# Altium schematic sheet ltc1474_400mA.SchDoc
size A4
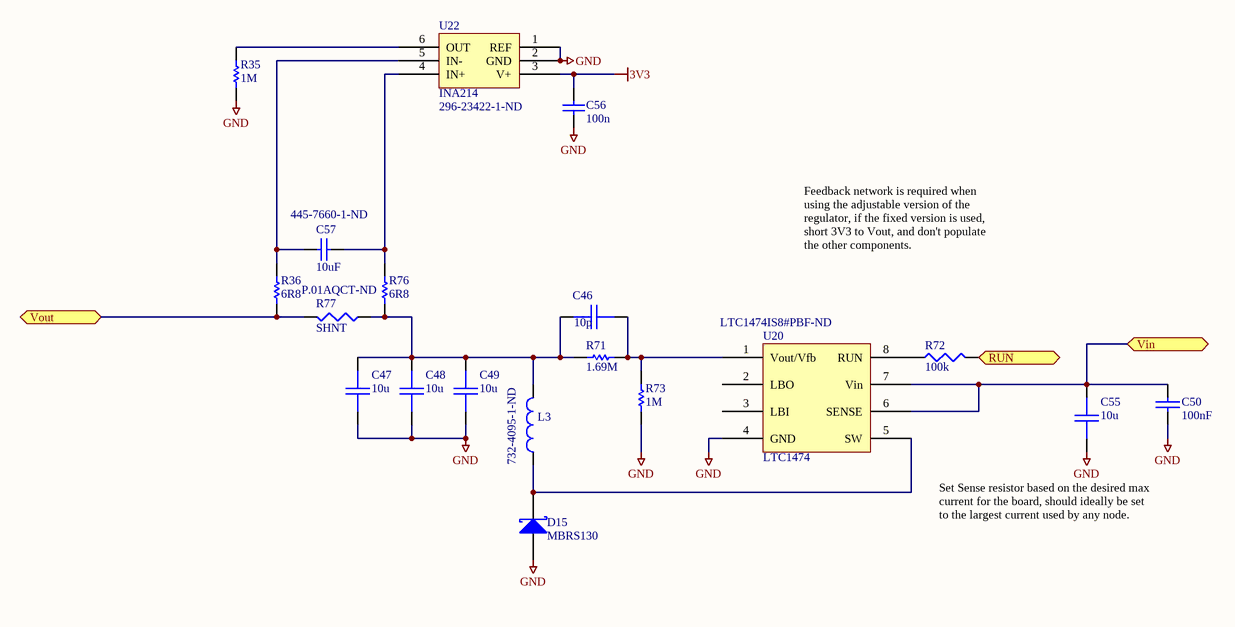
[diagram p0: ltc1474_400mA.SchDoc]

## Parts
C46  10p  [0603]
C47  10u  [1206]
C48  10u  [1206]
C49  10u  [1206]
C50  100nF  [0603]
C55  10u  [1206]
C56  100n  [0603]
C57  10uF  Supplier Part Number 1: 445-7660-1-ND  [0805]
D15  MBRS130  [SMB]
L3  Supplier Part Number 1: 732-4095-1-ND  [WE-TPC-744065221]  (hidden comment: INDUCTOR)
R35  1M  [0603]
R36  6R8  [0603]
R71  1.69M  [0603]
R72  100k  [0603]
R73  1M  [0603]
R76  6R8  [0603]
R77  SHNT  Supplier Part Number 1: P.01AQCT-ND  [0805]
U20  LTC1474  Supplier Part Number 1: LTC1474IS8#PBF-ND  [SO8]
U22  INA214  Supplier Part Number 1: 296-23422-1-ND  [SC70-6]

## Ports
RUN, Vin, Vout

## Nets
3V3: C56.2 U22.3(V+)
GND: C47.2 C48.2 C49.2 C50.2 C55.2 C56.1 D15.A R35.1 R73.1 U20.4(GND) U22.1(REF) U22.2(GND)
RUN: R72.2 ; port RUN
Vin: C50.1 C55.1 U20.6(SENSE) U20.7(Vin) ; port Vin
Vout: R36.2 R77.2 ; port Vout
NetC46_1: C46.1 C47.1 C48.1 C49.1 L3.2 R71.1 R76.2 R77.1
NetC46_2: C46.2 R71.2 R73.2 U20.1(Vout/Vfb)
NetC57_1: C57.1 R36.1 U22.5(IN-)
NetC57_2: C57.2 R76.1 U22.4(IN+)
NetD15_K: D15.K L3.1 U20.5(SW)
NetR35_2: R35.2 U22.6(OUT)
NetR72_1: R72.1 U20.8(RUN)

Not connected (* = marked no-connect by the designer): U20 2(LBO) 3(LBI)

## Notes on the sheet
- Feedback network is required when using the adjustable version of the regulator, if the fixed version is used, short 3V3 to Vout, and don't populate the other components.
- (near C55) Set Sense resistor based on the desired max current for the board, should ideally be set to the largest current used by any node.

## Library data of the parts
C46 = CAP: Capacitor; Manufacturer: TDK Corporation; Manufacturer Part Number: C1608C0G1H100D080AA; Value: 1nF; Description: CAP CER 10PF 50V NP0 0603; Capacitance: 10pF; Voltage - Rated: 50V; Tolerance: ±0.5pF; Temperature Coefficient: C0G, NP0; Revision: July-2002: Re-released for DXP Platform.; Farnell: 317-202; Price: 0.15; Supplier 1: Digi-Key; Supplier Part Number 1: 445-1269-1-ND; RoHS: RoHS Compliant; Category: Capacitors; Stock 1: 206915; Pricing 1: 1=0.12, 10=0.043, 100=0.0198, 250=0.01624, 500=0.0139, 1000=0.01082 (AUD); Packaging: Cut Tape (CT); Mounting Type: Surface Mount, MLCC; Operating Temperature: -55°C ~ 125°C; Applications: General Purpose; Ratings: -; Package / Case: 0603 (1608 Metric); Size / Dimension: 0.063" L x 0.031" W (1.60mm x 0.80mm); Height - Seated (Max): -; Thickness (Max): 0.037" (0.95mm); Lead Spacing: -; Features: -; Lead Style: -; ComponentLink1URL: http://product.tdk.com/capacitor/mlcc/en/documents/mlcc_commercial_general_en.pdf; ComponentLink1Description: http://product.tdk.com/capacitor/mlcc/en/documents/mlcc_commercial_general_en.pdf
C47-C49 C55 = CAP: Capacitor; Manufacturer: TDK Corporation; Manufacturer Part Number: C3216X5R1A106M160AB; Description: CAP CER 10UF 10V 20% X5R 1206; Capacitance: 10µF; Voltage - Rated: 10V; Tolerance: ±20%; Temperature Coefficient: X5R; Supplier 1: Digi-Key; Supplier Part Number 1: 445-1387-1-ND; RoHS: RoHS Compliant; Category: Capacitors; Stock 1: 132841; Pricing 1: 1=0.32, 10=0.274, 100=0.137, 250=0.10276, 500=0.09076, 1000=0.0805 (AUD); Packaging: Cut Tape (CT); Mounting Type: Surface Mount, MLCC; Operating Temperature: -55°C ~ 85°C; Applications: General Purpose; Ratings: -; Package / Case: 1206 (3216 Metric); Size / Dimension: 0.126" L x 0.063" W (3.20mm x 1.60mm); Height - Seated (Max): -; Thickness (Max): 0.071" (1.80mm); Lead Spacing: -; Features: -; Lead Style: -; ComponentLink1URL: http://product.tdk.com/capacitor/mlcc/en/documents/mlcc_commercial_general_en.pdf; ComponentLink1Description: http://product.tdk.com/capacitor/mlcc/en/documents/mlcc_commercial_general_en.pdf
C50 = CAP: Capacitor; Manufacturer: TDK Corporation; Manufacturer Part Number: C1608X7R1H103K080AA; Needed?: NO - HW LAB; Description: CAP CER 10000PF 50V 10% X7R 0603; Capacitance: 10000pF; Voltage - Rated: 50V; Tolerance: ±10%; Temperature Coefficient: X7R; Value: 100nF; Supplier 1: Digi-Key; Supplier Part Number 1: 445-1311-1-ND; RoHS: RoHS Compliant; Category: Capacitors; Stock 1: 569984; Pricing 1: 1=0.14, 10=0.035, 100=0.0159, 250=0.01296, 500=0.0111, 1000=0.00865 (AUD); Packaging: Cut Tape (CT); Mounting Type: Surface Mount, MLCC; Operating Temperature: -55°C ~ 125°C; Applications: General Purpose; Ratings: -; Package / Case: 0603 (1608 Metric); Size / Dimension: 0.063" L x 0.031" W (1.60mm x 0.80mm); Height - Seated (Max): -; Thickness (Max): 0.037" (0.95mm); Lead Spacing: -; Features: -; Lead Style: -; ComponentLink1URL: http://product.tdk.com/capacitor/mlcc/en/documents/mlcc_commercial_general_en.pdf; ComponentLink1Description: http://product.tdk.com/capacitor/mlcc/en/documents/mlcc_commercial_general_en.pdf
C56 = Cap Semi: Capacitor (Semiconductor SIM Model); Value: 100nF; Published: 8-Jun-2000; LatestRevisionDate: 17-Jul-2002; LatestRevisionNote: Re-released for DXP Platform.; PackageReference: C1206; Publisher: Altium Limited; Element14: 9406140; Element14 Price: 0.13
C57 = Cap Semi: Capacitor (Semiconductor SIM Model); Manufacturer: TDK Corporation; Manufacturer Part Number: C2012X5R1A106K125AB; Description: CAP CER 10UF 10V 10% X5R 0805; Capacitance: 10µF; Voltage - Rated: 10V; Tolerance: ±10%; Temperature Coefficient: X5R; Value: 10uF; Element14: 1458902RL; Element14 Price: 0.69; Supplier 1: Digi-Key; RoHS: RoHS Compliant; Category: Capacitors; Stock 1: 260840; Pricing 1: 1=0.24, 10=0.163, 100=0.0833, 250=0.06744, 500=0.05948, 1000=0.05057 (AUD); Packaging: Cut Tape (CT); Mounting Type: Surface Mount, MLCC; Operating Temperature: -55°C ~ 85°C; Applications: General Purpose; Ratings: -; Package / Case: 0805 (2012 Metric); Size / Dimension: 0.079" L x 0.049" W (2.00mm x 1.25mm); Height - Seated (Max): -; Thickness (Max): 0.057" (1.45mm); Lead Spacing: -; Features: -; Lead Style: -; ComponentLink1URL: http://product.tdk.com/capacitor/mlcc/en/documents/mlcc_commercial_general_en.pdf; ComponentLink1Description: http://product.tdk.com/capacitor/mlcc/en/documents/mlcc_commercial_general_en.pdf
D15 = D SCHOTTKY: Schottky Diode; Manufacturer: Fairchild Semiconductor; Manufacturer Part Number: MBRS130L; Description: DIODE SCHOTTKY 30V 2A DO214AA; Voltage - DC Reverse (Vr) (Max): 30V; Current - Average Rectified (Io): 2A; Voltage - Forward (Vf) (Max) @ If: 445mV @ 2A; Speed: Fast Recovery =< 500ns, > 200mA (Io); Current - Reverse Leakage @ Vr: 1mA @ 30V; Revision: July-2002: Re-released for DXP Platform.; Farnell: 708-150; Price: 1.49; Supplier 1: Digi-Key; Supplier Part Number 1: MBRS130LFSCT-ND; RoHS: RoHS Compliant; Category: Discrete Semiconductor Products; Stock 1: 14124; Pricing 1: 1=0.54, 10=0.428, 25=0.3612, 100=0.2942, 250=0.24364, 500=0.20126, 1000=0.15074 (AUD); Packaging: Cut Tape (CT); Diode Type: Schottky; Reverse Recovery Time (trr): -; Capacitance @ Vr, F: -; Mounting Type: Surface Mount; Package / Case: DO-214AA, SMB; Supplier Device Package: DO-214AA (SMB); ComponentLink1URL: http://www.fairchildsemi.com/ds/MB/MBRS130L.pdf; ComponentLink1Description: http://www.fairchildsemi.com/ds/MB/MBRS130L.pdf
L3 = INDUCTOR: Manufacturer: Wurth Electronics Inc; Manufacturer Part Number: 744065221; Description: INDUCTOR POWER 220UH .50A SMD; Type: Ferrite Core; Inductance: 220µH; Current Rating: 500mA; Current - Saturation: 550mA; Tolerance: ±30%; Material - Core: Ferrite; Shielding: Shielded; DC Resistance (DCR): 1 Ohm Max; Frequency - Test: 100kHz; Supplier 1: Digi-Key; RoHS: RoHS Compliant; Category: Inductors, Coils, Chokes; Stock 1: 1996; Pricing 1: 1=4.4, 10=4.081, 25=3.768, 50=3.2652, 100=2.8885, 250=2.76292, 500=2.63734 (AUD); Packaging: Cut Tape (CT); Q @ Freq: -; Frequency - Self Resonant: -; Operating Temperature: -40°C ~ 125°C; Package / Case: Non Standard; Size / Dimension: 0.394" L x 0.394" W x 0.110" H (10.00mm x 10.00mm x 2.80mm); Mounting Type: Surface Mount; ComponentLink1URL: http://katalog.we-online.de/pbs/datasheet/744065221.pdf; ComponentLink1Description: http://katalog.we-online.de/pbs/datasheet/744065221.pdf
R35 R73 = Res Semi: Semiconductor Resistor; Manufacturer: Panasonic Electronic Components; Manufacturer Part Number: ERJ-3EKF1004V; Value: R0; Description: RES 1M OHM 1/10W 1% 0603 SMD; Power (Watts): 0.1W, 1/10W; Temperature Coefficient: ±100ppm/°C; Tolerance: ±1%; Published: 8-Jun-2000; LatestRevisionDate: 17-Jul-2002; LatestRevisionNote: Re-released for DXP Platform.; PackageReference: AXIAL-0.5; Publisher: Altium Limited; PackageDescription: Axial Device, Thru-Hole; 2 Leads; 0.5 in Pin Spacing; Supplier 1: Digi-Key; Supplier Part Number 1: P1.00MHCT-ND; RoHS: RoHS Compliant; Category: Resistors; Stock 1: 1075295; Pricing 1: 1=0.12, 50=0.0166, 100=0.0126, 250=0.00936, 500=0.00692, 1000=0.00461 (AUD); Packaging: Cut Tape (CT); Resistance (Ohms): 1M; Composition: Thick Film; Features: -; Package / Case: 0603 (1608 Metric); Supplier Device Package: 0603; Size / Dimension: 0.063" L x 0.031" W (1.60mm x 0.80mm); Height: 0.022" (0.55mm); Number of Terminations: 2; ComponentLink1URL: http://industrial.panasonic.com/www-cgi/jvcr13pz.cgi?E+PZ+3+AOA0002+ERJ3EKF1004V+7+WW; ComponentLink1Description: http://industrial.panasonic.com/www-cgi/jvcr13pz.cgi?E+PZ+3+AOA0002+ERJ3EKF1004V+7+WW
R36 R76 = Res Semi: Semiconductor Resistor; Manufacturer: Panasonic Electronic Components; Manufacturer Part Number: ERJ-3GEYJ6R8V; Description: RES 6.8 OHM 1/10W 5% 0603 SMD; Resistance (Ohms): 6.8; Power (Watts): 0.1W, 1/10W; Temperature Coefficient: -100/ +600ppm/°C; Tolerance: ±5%; Published: 8-Jun-2000; LatestRevisionDate: 17-Jul-2002; LatestRevisionNote: Re-released for DXP Platform.; PackageReference: AXIAL-0.5; Publisher: Altium Limited; Value: 6R8; Element14: 9331492RL; Element14 Price: 0.08 (min order 50); Supplier 1: Digi-Key; Supplier Part Number 1: P6.8GCT-ND; RoHS: RoHS Compliant; Category: Resistors; Stock 1: 133530; Pricing 1: 1=0.12, 50=0.011, 100=0.0084, 250=0.00624, 500=0.00462, 1000=0.00308 (AUD); Packaging: Cut Tape (CT); Composition: Thick Film; Features: -; Package / Case: 0603 (1608 Metric); Supplier Device Package: 0603; Size / Dimension: 0.063" L x 0.031" W (1.60mm x 0.80mm); Height: 0.022" (0.55mm); Number of Terminations: 2; ComponentLink1URL: http://industrial.panasonic.com/www-cgi/jvcr13pz.cgi?E+PZ+3+AOA0001+ERJ3GEYJ6R8V+7+WW; ComponentLink1Description: http://industrial.panasonic.com/www-cgi/jvcr13pz.cgi?E+PZ+3+AOA0001+ERJ3GEYJ6R8V+7+WW
R71 = Res Semi: Semiconductor Resistor; Manufacturer: Samsung Electro-Mechanics America, Inc; Manufacturer Part Number: RC1608F1694CS; Value: R0; Description: RES 1.69M OHM 1/10W 1% 0603; Power (Watts): 0.1W, 1/10W; Temperature Coefficient: ±300ppm/°C; Tolerance: ±1%; Published: 8-Jun-2000; LatestRevisionDate: 17-Jul-2002; LatestRevisionNote: Re-released for DXP Platform.; PackageReference: AXIAL-0.5; Publisher: Altium Limited; PackageDescription: Axial Device, Thru-Hole; 2 Leads; 0.5 in Pin Spacing; Supplier 1: Digi-Key; Supplier Part Number 1: 1276-4940-1-ND; RoHS: RoHS Compliant; Category: Resistors; Stock 1: 9990; Pricing 1: 1=0.12, 10=0.023, 25=0.0168, 50=0.0128, 100=0.0094, 250=0.00716, 500=0.00572, 1000=0.00421, 2500=0.00365 (AUD); Packaging: Cut Tape (CT); Resistance (Ohms): 1.69M; Composition: Thick Film; Features: -; Package / Case: 0603 (1608 Metric); Supplier Device Package: 0603 (1608 Metric); Size / Dimension: 0.063" L x 0.031" W (1.60mm x 0.80mm); Height: 0.022" (0.55mm); Number of Terminations: 2; ComponentLink1URL: http://www.samsungsem.com/servlet/FileDownload?filename=productcatalog/pdf/Chip_Resistor.pdf; ComponentLink1Description: http://www.samsungsem.com/servlet/FileDownload?filename=productcatalog/pdf/Chip_Resistor.pdf
R72 = RES1: Resistor; Manufacturer: Panasonic Electronic Components; Manufacturer Part Number: ERJ-3EKF1003V; Description: RES 100K OHM 1/10W 1% 0603 SMD; Power (Watts): 0.1W, 1/10W; Temperature Coefficient: ±100ppm/°C; Tolerance: ±1%; Supplier 1: Digi-Key; Supplier Part Number 1: P100KHCT-ND; RoHS: RoHS Compliant; Category: Resistors; Stock 1: 8186012; Pricing 1: 1=0.12, 50=0.0166, 100=0.0126, 250=0.00936, 500=0.00692, 1000=0.00461 (AUD); Packaging: Cut Tape (CT); Resistance (Ohms): 100k; Composition: Thick Film; Features: -; Package / Case: 0603 (1608 Metric); Supplier Device Package: 0603; Size / Dimension: 0.063" L x 0.031" W (1.60mm x 0.80mm); Height: 0.022" (0.55mm); Number of Terminations: 2; ComponentLink1URL: http://industrial.panasonic.com/www-cgi/jvcr13pz.cgi?E+PZ+3+AOA0002+ERJ3EKF1003V+7+WW; ComponentLink1Description: http://industrial.panasonic.com/www-cgi/jvcr13pz.cgi?E+PZ+3+AOA0002+ERJ3EKF1003V+7+WW
R77 = Res3: Resistor; Manufacturer: Panasonic Electronic Components; Manufacturer Part Number: ERJ-6BWFR010V; Description: RES 0.01 OHM 1/2W 1% 0805 SMD; Resistance (Ohms): 0.01; Power (Watts): 0.5W, 1/2W; Temperature Coefficient: ±300ppm/°C; Tolerance: ±1%; Publisher: Altium Limited; Element14: 8067520; Element14 Price: 0.62; Supplier 1: Digi-Key; RoHS: RoHS Compliant; Category: Resistors; Stock 1: 6983; Pricing 1: 1=1.38, 50=0.7394, 100=0.6469, 250=0.573, 500=0.48058, 1000=0.36967 (AUD); Packaging: Cut Tape (CT); Composition: Thick Film; Features: -; Package / Case: 0805 (2012 Metric); Supplier Device Package: 0805; Size / Dimension: 0.079" L x 0.049" W (2.00mm x 1.25mm); Height: 0.030" (0.75mm); Number of Terminations: 2; ComponentLink1URL: http://industrial.panasonic.com/www-data/pdf/AOA0000/AOA0000CE3.pdf; ComponentLink1Description: http://industrial.panasonic.com/www-data/pdf/AOA0000/AOA0000CE3.pdf
U20 = LTC1474: Step-down converter; Manufacturer: Linear Technology; Manufacturer Part Number: LTC1474IS8#PBF; Description: IC REG BUCK ADJ 0.75A 8SOIC; Output Type: Adjustable; Number of Outputs: 1; Voltage - Input: 3 V ~ 18 V; PWM Type: Burst Mode®; Current - Output: 750mA; Synchronous Rectifier: No; Farnell: NA; Supplier 1: Digi-Key; RoHS: RoHS Compliant; Category: Integrated Circuits (ICs); Stock 1: 587; Pricing 1: 1=9.96, 25=6.616, 100=5.2879 (AUD); Packaging: Tube; Type: Step-Down (Buck); Voltage - Output: Adjustable; Frequency - Switching: -; Operating Temperature: -40°C ~ 85°C; Mounting Type: Surface Mount; Package / Case: 8-SOIC (0.154", 3.90mm Width); Supplier Device Package: 8-SOIC; ComponentLink1URL: http://www.linear.com/docs/1377; ComponentLink1Description: http://www.linear.com/docs/1377
U22 = INA214: Current Shunt Monitor; Manufacturer: Texas Instruments; Manufacturer Part Number: INA214AIDCKT; Description: IC CURRENT MONITOR 1% SC70-6; Function: Current Monitor; Sensing Method: High/Low-Side; Accuracy: ±1%; Voltage - Input: 2.7 V ~ 26 V; Element14: 1754262; Element14 Price: $4.22; Supplier 1: Digi-Key; RoHS: RoHS Compliant; Category: Integrated Circuits (ICs); Stock 1: 2023; Pricing 1: 1=2.58, 10=2.336, 25=2.0932, 100=1.0952 (AUD); Packaging: Cut Tape (CT); Current - Output: -; Operating Temperature: -40°C ~ 125°C; Mounting Type: Surface Mount; Package / Case: 6-TSSOP, SC-88, SOT-363; Supplier Device Package: SC-70-6; ComponentLink1URL: http://www.ti.com/lit/ds/symlink/ina210.pdf; ComponentLink1Description: http://www.ti.com/lit/ds/symlink/ina210.pdf